# Altium schematic sheet BatteryCharger.SchDoc (part 2 of 2)
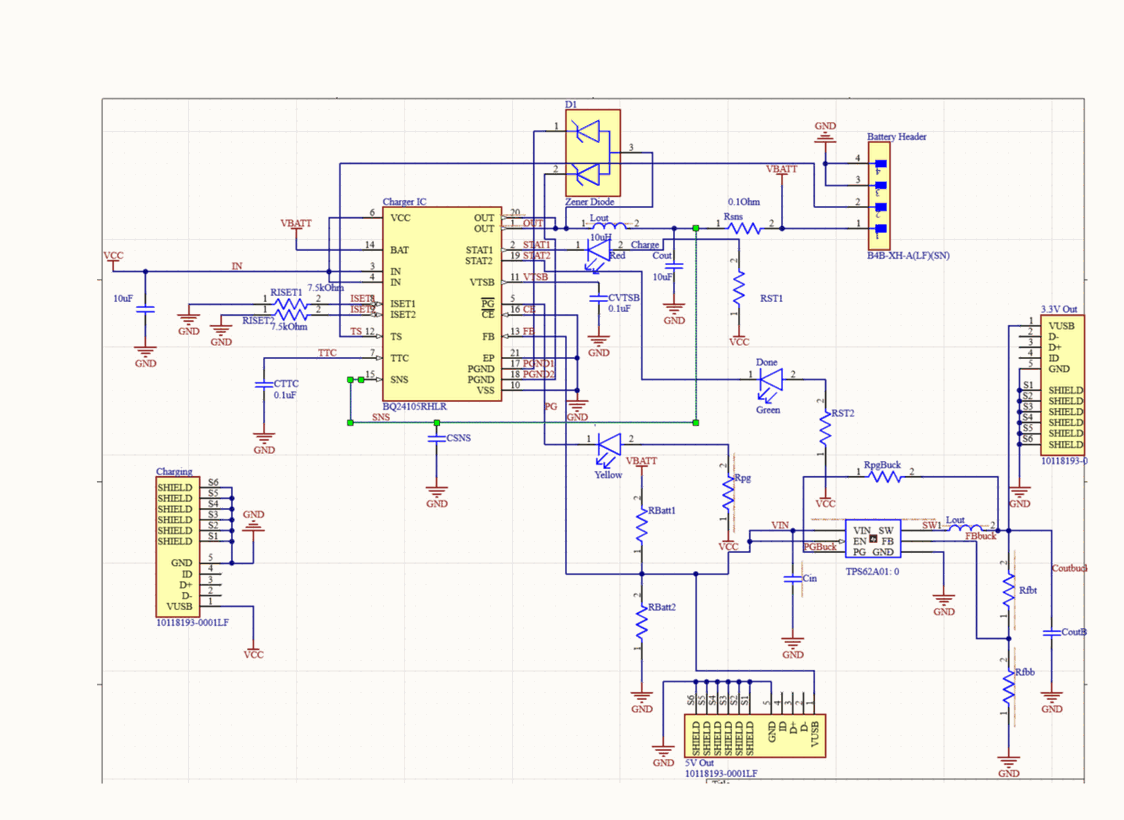
[diagram p2: BatteryCharger.SchDoc, right]

## Library data of the parts
3.3V_Out 5V_Out Charging = 10118193-0001LF: FCI Right Angle Surface Mount Mount Female USB Connector; 100 V ac; 1.8A; Manufacturer: Amphenol ICC / FCI; Connector Type: USB,Receptacle; Number of Contacts: 5; Number of Ports: 1; Insulation Resistance: 1GR; Max Voltage Rating (AC): 100V; Pitch: 0.65mm; Supplier: Allied Electronics; Supplier Part Number: 70236827; Manufacturer Part Number: 10118193-0001LF; RoHS: No; Category: USB Connectors; Mounting Technology: Surface Mount,Horizontal; Pins: 5; Contact Plating: Gold; Color: Black; Contact Material: Copper Alloy; Housing Material: Polymer; Min Operating Temperature: -55°C; Max Operating Temperature: 85°C; Packaging: Tape and Reel; Gender: Female; Termination: Solder; Series: -; Current Rating: 1.8A; Package Quantity: 1200; Orientation: Right Angle; Features: Shielded; Voltage Rating: 100V; Length: 7.86mm; Depth: 5.67mm; Radiation Hardening: No; Flammability Rating: UL94 V-0; ComponentLink1URL: http://uk.rs-online.com/webdocs/1450/0900766b814507f1.pdf?src-supplier=Rs; ComponentLink1Description: http://uk.rs-online.com/webdocs/1450/0900766b814507f1.pdf?src-supplier=Rs; ComponentLink2URL: https://cdn.amphenol-icc.com/media/wysiwyg/files/documentation/datasheet/inputoutput/io_usb_micro.pdf?src-supplier=Rs; ComponentLink2Description: https://cdn.amphenol-icc.com/media/wysiwyg/files/documentation/datasheet/inputoutput/io_usb_micro.pdf?src-supplier=Rs; ComponentLink3URL: https://cdn.amphenol-icc.com/media/wysiwyg/files/documentation/datasheet/inputoutput/io_usb_micro.pdf?src-supplier=Onlinecomponents.com; ComponentLink3Description: https://cdn.amphenol-icc.com/media/wysiwyg/files/documentation/datasheet/inputoutput/io_usb_micro.pdf?src-supplier=Onlinecomponents.com; ComponentLink4URL: https://cdn.amphenol-icc.com/media/wysiwyg/files/documentation/datasheet/inputoutput/io_usb_micro.pdf?src-supplier=Arrow+Electronics; ComponentLink4Description: https://cdn.amphenol-icc.com/media/wysiwyg/files/documentation/datasheet/inputoutput/io_usb_micro.pdf?src-supplier=Arrow+Electronics; ComponentLink5URL: https://cdn.amphenol-icc.com/media/wysiwyg/files/documentation/datasheet/inputoutput/io_usb_micro.pdf?src-supplier=Allied+Electronics; ComponentLink5Description: https://cdn.amphenol-icc.com/media/wysiwyg/files/documentation/datasheet/inputoutput/io_usb_micro.pdf?src-supplier=Allied+Electronics; ComponentLink6URL: https://cdn.amphenol-icc.com/media/wysiwyg/files/documentation/datasheet/inputoutput/io_usb_micro.pdf?src-supplier=Verical; ComponentLink6Description: https://cdn.amphenol-icc.com/media/wysiwyg/files/documentation/datasheet/inputoutput/io_usb_micro.pdf?src-supplier=Verical; ComponentLink7URL: https://cdn.amphenol-icc.com/media/wysiwyg/files/documentation/datasheet/inputoutput/io_usb_micro.pdf?src-supplier=Avnet; ComponentLink7Description: https://cdn.amphenol-icc.com/media/wysiwyg/files/documentation/datasheet/inputoutput/io_usb_micro.pdf?src-supplier=Avnet; ComponentLink8URL: https://cdn.amphenol-icc.com/media/wysiwyg/files/documentation/datasheet/inputoutput/io_usb_micro.pdf?src-supplier=Mouser; ComponentLink8Description: https://cdn.amphenol-icc.com/media/wysiwyg/files/documentation/datasheet/inputoutput/io_usb_micro.pdf?src-supplier=Mouser; ComponentLink9URL: http://www.amphenol-icc.com/media/wysiwyg/files/drawing/10118193.pdf?src-supplier=Digi-Key; ComponentLink9Description: http://www.amphenol-icc.com/media/wysiwyg/files/drawing/10118193.pdf?src-supplier=Digi-Key; ComponentLink10URL: https://cdn.amphenol-icc.com/media/wysiwyg/files/documentation/datasheet/inputoutput/io_usb_micro.pdf?src-supplier=Digi-Key; ComponentLink10Description: https://cdn.amphenol-icc.com/media/wysiwyg/files/documentation/datasheet/inputoutput/io_usb_micro.pdf?src-supplier=Digi-Key; ComponentLink11URL: https://cdn.amphenol-icc.com/media/wysiwyg/files/documentation/datasheet/inputoutput/io_usb_micro.pdf?src-supplier=Heilind+Electronics; ComponentLink11Description: https://cdn.amphenol-icc.com/media/wysiwyg/files/documentation/datasheet/inputoutput/io_usb_micro.pdf?src-supplier=Heilind+Electronics; ComponentLink12URL: https://cdn.amphenol-icc.com/media/wysiwyg/files/documentation/datasheet/inputoutput/io_usb_micro.pdf?src-supplier=TTI; ComponentLink12Description: https://cdn.amphenol-icc.com/media/wysiwyg/files/documentation/datasheet/inputoutput/io_usb_micro.pdf?src-supplier=TTI; ComponentLink13URL: https://cdn.amphenol-icc.com/media/wysiwyg/files/documentation/datasheet/inputoutput/io_usb_micro.pdf?src-supplier=TME; ComponentLink13Description: https://cdn.amphenol-icc.com/media/wysiwyg/files/documentation/datasheet/inputoutput/io_usb_micro.pdf?src-supplier=TME
10uF ? CoutBuck = TMK212BBJ106MGHT: Cap Ceramic 10uF 25V X5R 20% Pad SMD 0805 85C Low ESR Automotive T/R; Manufacturer: Taiyo Yuden; Supplier: Newark; Supplier Part Number: 16AC1902; Manufacturer Part Number: TMK212BBJ106MGHT; RoHS: Yes; Category: Ceramic Capacitors; Stock: 444; Pricing: 1=0.31000, 25=0.16600, 50=0.13900, 100=0.11200, 250=0.09800 (USD); Mounting Technology: Surface Mount; Case/Package: 0805; Min Operating Temperature: -55°C; Max Operating Temperature: 85°C; Packaging: Tape and Reel; Value: 10uF; Tolerance: 20%; Voltage Rating: 25V; Series: M; Ratings: AEC-Q200; RoHS Compliant: Yes; ComponentLink1URL: http://www.farnell.com/datasheets/2842303.pdf?src-supplier=Farnell; ComponentLink1Description: http://www.farnell.com/datasheets/2842303.pdf?src-supplier=Farnell; ComponentLink2URL: http://ds.yuden.co.jp/TYCOMPAS/ut/detail.do?productNo=TMK212BBJ106MGHT&fileName=TMK212BBJ106MGHT_SS&mode=specSheetDownload&src-supplier=Digi-Key; ComponentLink2Description: http://ds.yuden.co.jp/TYCOMPAS/ut/detail.do?productNo=TMK212BBJ106MGHT&fileName=TMK212BBJ106MGHT_SS&mode=specSheetDownload&src-supplier=Digi-Key; ComponentLink3URL: http://www.farnell.com/datasheets/2842303.pdf?src-supplier=Newark; ComponentLink3Description: http://www.farnell.com/datasheets/2842303.pdf?src-supplier=Newark
' = LYR976-PS-36: LED Uni-Color Yellow 591nm 2-Pin SMT T/R; Manufacturer: Osram Opto; Lens Color: White; Forward Current: 25mA; Forward Voltage: 2.5V; Lens Style: Flat,Diffused,Colorless,Rectangular; Luminous Intensity: 280mcd; Viewing Angle: 160°; Test Current: 20mA; Dominant Wavelength: 588nm; Luminous Flux: 0.735lm; Number of Elements: 1; Reverse Voltage: 12V; Power Dissipation: 65mW; Lens Transparency: Diffused; Lens Size: 1.25mm; Supplier: Mouser; Supplier Part Number: 720-LYR976-PS-36; Manufacturer Part Number: LYR976-PS-36; RoHS: Yes; Category: LEDs; Stock: 181357; Pricing: 1=0.30000, 10=0.16500, 50=0.16500, 100=0.07700, 500=0.07100, 1000=0.05500, 5000=0.04700, 10000=0.04300, 16000=0.03700 (USD); Mounting Technology: Surface Mount; Case/Package: 0805; Pins: 2; Color: Yellow; Case Code (Imperial): 0805; Case Code (Metric): 2012; Min Operating Temperature: -30°C; Max Operating Temperature: 85°C; Packaging: Tape and Reel; Number of LEDs: 1; Illumination Color: Yellow; Package Quantity: 16000; Series: CHIPLED 0805; Length: 2.1mm; Width: 1.25mm; Depth: 1.35mm; Radiation Hardening: No; RoHS Compliant: Yes; ComponentLink1URL: https://datasheet.ciiva.com/26883/getdatasheetpartid-623478-26883141.pdf?src-supplier=Verical; ComponentLink1Description: https://datasheet.ciiva.com/26883/getdatasheetpartid-623478-26883141.pdf?src-supplier=Verical; ComponentLink2URL: https://datasheet.ciiva.com/26937/getdatasheetpartid-569561-26937231.pdf?src-supplier=Verical; ComponentLink2Description: https://datasheet.ciiva.com/26937/getdatasheetpartid-569561-26937231.pdf?src-supplier=Verical
Battery_Header = B4B-XH-A(LF)(SN): XH Series 4 Position 2.5 mm Pitch Through Hole Crimp Top Entry Shrouded Header; Manufacturer: JST; Contact Resistance: 20mR; Current Rating: 3A; Voltage Rating (AC): 250V; Number of Positions: 4; Insulation Resistance: 1GR; Gender: Male; Wire/Cable Gauge: 22AWG; Pitch: 2.5mm; Mated Stacking Heights: 9.8mm; Supplier: Future Electronics; Supplier Part Number: 8134090; Manufacturer Part Number: B4B-XH-A(LF)(SN); RoHS: Yes; Category: Headers and Wire Housings; Stock: 310237; Pricing: 1=0.09880, 400=0.09510, 1500=0.09040, 4000=0.08710, 15000=0.07980 (USD); Mounting Technology: Through Hole; Contact Plating: Tin,Lead,Copper; Contact Material: Brass; Color: Natural; Housing Color: White; Housing Material: Polyamide; Material: Polyamide; Contact Shape: Square; Contact Finish - Mating: TIN; Insulation Material: Nylon; Insulation Color: Natural; Min Operating Temperature: -25°C; Max Operating Temperature: 85°C; Number of Rows: 1; Max Current Rating: 3A; Packaging: Bulk; Voltage Rating: 250V; Termination: Solder; Max Voltage Rating (AC): 250V; Max Voltage Rating (DC): 250V; Number of Contacts: 4; Orientation: Straight; Connector Type: Header; Series: XH; Contact Type: Male Pin; Fastening Type: Detent; Length: 12.4mm; Lead Pitch: 2.5mm; Depth: 5.75mm; Reach SVHC Compliant: No; Lead Free: Lead Free; Flammability Rating: UL94 V-0; ComponentLink1URL: https://datasheet.ciiva.com/16203/b4b-xh-alfsn-16203642.pdf?src-supplier=Future+Electronics; ComponentLink1Description: https://datasheet.ciiva.com/16203/b4b-xh-alfsn-16203642.pdf?src-supplier=Future+Electronics; ComponentLink2URL: https://datasheet.ciiva.com/26894/getdatasheetpartid-455616-26894787.pdf?src-supplier=Verical; ComponentLink2Description: https://datasheet.ciiva.com/26894/getdatasheetpartid-455616-26894787.pdf?src-supplier=Verical; ComponentLink3URL: https://datasheet.ciiva.com/26924/getdatasheetpartid-640571-26924035.pdf?src-supplier=Verical; ComponentLink3Description: https://datasheet.ciiva.com/26924/getdatasheetpartid-640571-26924035.pdf?src-supplier=Verical; ComponentLink4URL: https://datasheet.ciiva.com/726/exh-726404.pdf?src-supplier=Digi-Key; ComponentLink4Description: https://datasheet.ciiva.com/726/exh-726404.pdf?src-supplier=Digi-Key
Buck = TPS62A01ADRL_TRANS: Manufacturer: Texas Instruments; DeviceDesignator: A; DeviceNumbering: Alpha; DevicesInPackage: 1; IsHeterogeneous: False; OriginalSymbolOrigin: (20000,20000); PCB Footprint: DRL0006A-MFG; PSpiceTemplate: X^@REFDES %EN %FB %GND %PG %SW %VIN @MODEL PARAMS: ?SS|SS=@SS||SS=0|; < Value >: TPS62A01ADRL_TRANS; DevicesInView: 1; PackageName: TPS62A01ADRL; PartNumber: TPS62A01ADRL
Charge = LSR976-NR-1: Led SMT Red 0805 Tape; Manufacturer: Osram Opto; Lens Color: White; Viewing Angle: 160°; Lens Style: Flat,Diffused,Colorless,Rectangular; Dominant Wavelength: 633nm; Luminous Flux: 0.47lm; Number of LEDs: 1; Forward Current: 25mA; Forward Voltage: 2.5V; Luminous Intensity: 180mcd; Test Current: 20mA; Power Dissipation: 65mW; Reverse Voltage: 12V; Lens Transparency: Diffused; Lens Size: 1.25mm; Supplier: Avnet; Supplier Part Number: Q62702P5178; Manufacturer Part Number: LSR976-NR-1; RoHS: Yes; Category: LEDs; Stock: 76000; Pricing: 4000=0.03250, 8000=0.03167, 16000=0.03084, 24000=0.03002, 32000=0.02919, 40000=0.02836, 400000=0.02753 (USD); Mounting Technology: Surface Mount; Case/Package: 0805; Pins: 2; Color: Red; Case Code (Metric): 2012; Case Code (Imperial): 0805; Min Operating Temperature: -30°C; Max Operating Temperature: 85°C; Packaging: Tape and Reel; Illumination Color: Red; Package Quantity: 16000; Number of Elements: 1; Series: CHIPLED 0805; Length: 2.1mm; Width: 1.25mm; Height: 0.9mm; Depth: 1.35mm; Radiation Hardening: No; RoHS Compliant: Yes; ComponentLink1URL: https://datasheet.ciiva.com/4688/o-ls-ly-r976-24152-4688435.pdf?src-supplier=Mouser; ComponentLink1Description: https://datasheet.ciiva.com/4688/o-ls-ly-r976-24152-4688435.pdf?src-supplier=Mouser; ComponentLink2URL: https://datasheet.ciiva.com/26920/getdatasheetpartid-568367-26920831.pdf?src-supplier=Verical; ComponentLink2Description: https://datasheet.ciiva.com/26920/getdatasheetpartid-568367-26920831.pdf?src-supplier=Verical; ComponentLink3URL: https://datasheet.ciiva.com/2112/00078896-0-2112782.pdf?src-supplier=Digi-Key; ComponentLink3Description: https://datasheet.ciiva.com/2112/00078896-0-2112782.pdf?src-supplier=Digi-Key; ComponentLink4URL: https://datasheet.ciiva.com/2112/00078896-0-2112781.pdf?src-supplier=Digi-Key; ComponentLink4Description: https://datasheet.ciiva.com/2112/00078896-0-2112781.pdf?src-supplier=Digi-Key; ComponentLink5URL: https://datasheet.ciiva.com/2112/00078896-0-2112783.pdf?src-supplier=Digi-Key; ComponentLink5Description: https://datasheet.ciiva.com/2112/00078896-0-2112783.pdf?src-supplier=Digi-Key
Charger_IC = BQ24105RHLR: Charger IC Multi-Chemistry 20-VQFN (3.5x4.5); Manufacturer: Texas Instruments; Number of Cells: 123; Max Supply Voltage: 16V; Min Supply Voltage: 4.35V; Output Voltage: 15.5V; Output Current: 2A; Min Input Voltage: 4.3V; Switching Frequency: 1.1MHz; Max Output Voltage: 8.4V; Fault Protection: Over Voltage,Over Temperature; Supplier: Mouser; Supplier Part Number: 595-BQ24105RHLR; Manufacturer Part Number: BQ24105RHLR; RoHS: Yes; Category: Battery Management; Stock: 3270; Pricing: 1=7.70000, 10=6.95000, 50=6.63000, 100=5.75000, 1000=4.57000, 10000=4.42000 (USD); Case/Package: VQFN EP; Pins: 20; Contact Plating: Gold; Weight: 0.001668oz; Min Operating Temperature: -40°C; Max Operating Temperature: 85°C; Packaging: Tape and Reel; Package Quantity: 1; Series: bqSWITCHER™; Max Output current: 2A; Max Charge Current: 2A; Battery Pack Voltage: 15.5V; Length: 4.5mm; Width: 3.5mm; Height: 0.9mm; Radiation Hardening: No; Lead Free: Lead Free; RoHS Compliant: Yes; Reach SVHC Compliant: No; ComponentLink1URL: https://datasheet.ciiva.com/22697/1822372-22697057.pdf?src-supplier=Element14; ComponentLink1Description: https://datasheet.ciiva.com/22697/1822372-22697057.pdf?src-supplier=Element14; ComponentLink2URL: https://datasheet.ciiva.com/1144/75479-1144736.pdf?src-supplier=Newark; ComponentLink2Description: https://datasheet.ciiva.com/1144/75479-1144736.pdf?src-supplier=Newark; ComponentLink3URL: https://datasheet.ciiva.com/15114/getdatasheetpartid-188126-15114478.pdf?src-supplier=Verical; ComponentLink3Description: https://datasheet.ciiva.com/15114/getdatasheetpartid-188126-15114478.pdf?src-supplier=Verical; ComponentLink4URL: https://datasheet.ciiva.com/1932/bq24100-1932834.pdf?src-supplier=Digi-Key; ComponentLink4Description: https://datasheet.ciiva.com/1932/bq24100-1932834.pdf?src-supplier=Digi-Key; ComponentLink5URL: https://datasheet.ciiva.com/1932/bq24100-1932833.pdf?src-supplier=Digi-Key; ComponentLink5Description: https://datasheet.ciiva.com/1932/bq24100-1932833.pdf?src-supplier=Digi-Key; ComponentLink6URL: https://datasheet.ciiva.com/1932/bq24100-1932835.pdf?src-supplier=Digi-Key; ComponentLink6Description: https://datasheet.ciiva.com/1932/bq24100-1932835.pdf?src-supplier=Digi-Key; ComponentLink7URL: https://datasheet.ciiva.com/4873/slus606o-82020-4873468.pdf?src-supplier=Mouser; ComponentLink7Description: https://datasheet.ciiva.com/4873/slus606o-82020-4873468.pdf?src-supplier=Mouser; ComponentLink8URL: https://datasheet.ciiva.com/1136/1831046-1136641.pdf?src-supplier=Element14; ComponentLink8Description: https://datasheet.ciiva.com/1136/1831046-1136641.pdf?src-supplier=Element14; ComponentLink9URL: https://datasheet.ciiva.com/3213/bq24115-3213497.pdf?src-supplier=Avnet; ComponentLink9Description: https://datasheet.ciiva.com/3213/bq24115-3213497.pdf?src-supplier=Avnet
Cin = C1210C156Z8VACTU: Capacitor; Ceramic; Cap; 15uF; Tol+80%; -20%; SMT; Vol-Rtg 10V; High Cap.; Y5V; Manufacturer: KEMET; Tolerance: 80%; Dissipation Factor: 10%; Supplier: Arrow Electronics; Supplier Part Number: C1210C156Z8VACTU; Manufacturer Part Number: C1210C156Z8VACTU; RoHS: Yes; Category: Ceramic Capacitors; Stock: 1032; Pricing: 1=0.44940, 10=0.43580, 25=0.43520, 100=0.41460, 250=0.41380, 500=0.38950, 1000=0.38420 (USD); Mounting Technology: Surface Mount,PCB; Case/Package: 1210; Case Code (Imperial): 1210; Case Code (Metric): 3225; Case Code: 1210; Min Operating Temperature: -30°C; Max Operating Temperature: 85°C; Value: 15uF; Voltage Rating (DC): 10V; Dielectric: Y5V; Package Quantity: 1; Voltage Rating: 10V; Packaging: Tape and Reel; Termination: SMD/SMT; Series: C1210C; Length: 3.2mm; Width: 0.098inch; Height: 1.55mm; Depth: 2.5mm; Thickness: 0.067inch; Lead Free: Lead Free; RoHS Compliant: Yes; ComponentLink1URL: https://datasheet.ciiva.com/14599/70095383-14599054.pdf?src-supplier=Allied+Electronics; ComponentLink1Description: https://datasheet.ciiva.com/14599/70095383-14599054.pdf?src-supplier=Allied+Electronics
CSNS CTTC CVTSB = C0805C104K4RACTU: Cap Ceramic 0.1uF 16V X7R 10% SMD 0805 125°C T/R; Manufacturer: KEMET; Value: 100nF; Supplier: Newark; Supplier Part Number: 05AC8015; Manufacturer Part Number: C0805C104K4RACTU; RoHS: Yes; Category: Ceramic Capacitors; Stock: 28000; Pricing: 1=0.04200, 4000=0.04200, 10000=0.03700, 20000=0.02900, 40000=0.02200 (USD); Mounting Technology: Surface Mount,PCB; Case/Package: 0805; Pins: 2; Case Code (Imperial): 0805; Case Code (Metric): 2012; Contact Plating: Tin,Matte; Dielectric Material: Ceramic; Min Operating Temperature: -55°C; Max Operating Temperature: 125°C; Packaging: Tape and Reel; Package Quantity: 4000; Tolerance: 10%; Voltage Rating: 16V; Voltage Rating (DC): 16V; Dielectric: X7R; Termination: SMD/SMT; Voltage: 16V; Series: SMD Comm X7R; Construction: Flat; Length: 2mm; Height: 0.9mm; Lead Pitch: 0.75mm; Depth: 1.25mm; Radiation Hardening: No; Reach SVHC Compliant: No; RoHS Compliant: Yes; ComponentLink1URL: https://datasheet.ciiva.com/46443/1851736-46443710.pdf?src-supplier=Element14; ComponentLink1Description: https://datasheet.ciiva.com/46443/1851736-46443710.pdf?src-supplier=Element14; ComponentLink2URL: https://datasheet.ciiva.com/46443/1851736-46443711.pdf?src-supplier=Element14; ComponentLink2Description: https://datasheet.ciiva.com/46443/1851736-46443711.pdf?src-supplier=Element14
D1 = MMBZ18VALT1G: ESD Suppressor Diode Zener Uni-Dir/Bi-Dir 14.5V 3-Pin SOT-23 T/R; Manufacturer: ON Semiconductor; Max Surge Current: 1.6A; Direction: Unidirectional; Number of Unidirectional Channels: 2; Min Breakdown Voltage: 17.1V; Clamping Voltage: 25V; Peak Pulse Power: 40W; Power Line Protection: No; Test Current: 1mA; Leakage Current: 50nA; Voltage Rating (DC): 18V; Max Power Dissipation: 225mW; ESD Protection: Yes; Max Breakdown Voltage: 18.9V; Supplier: Future Electronics; Supplier Part Number: 7295033; Manufacturer Part Number: MMBZ18VALT1G; RoHS: Yes; Category: Zener Diodes; Stock: 144000; Pricing: 3000=0.02150, 12000=0.02060, 45000=0.01970, 75000=0.01940, 150000=0.01850 (USD); Case/Package: SOT-23-3; Pins: 3; Min Operating Temperature: -55°C; Max Operating Temperature: 150°C; Packaging: Tape and Reel; Series: -; Package Quantity: 3000; Operating Supply Voltage: 14.5V; Reverse Standoff Voltage: 14.5V; Polarity: Unidirectional; Number of Channels: 2; Breakdown Voltage: 17.1V; Termination: SMD/SMT; Peak Pulse Current: 1.6A; Diode Type: ZENER; Number of Elements: 2; Reverse Breakdown Voltage: 17.1V; Working Voltage: 14.5V; Max Reverse Leakage Current: 50nA; Power Dissipation: 40W; Clamping Voltage-Max: 25V; Length: 2.9mm; Width: 1.4mm; Height: 1.01mm; Depth: 1.3mm; Radiation Hardening: No; RoHS Compliant: Yes; Lead Free: Lead Free; Reach SVHC Compliant: No; ComponentLink1URL: https://datasheet.ciiva.com/15143/getdatasheetpartid-110231-15143507.pdf?src-supplier=Verical; ComponentLink1Description: https://datasheet.ciiva.com/15143/getdatasheetpartid-110231-15143507.pdf?src-supplier=Verical; ComponentLink2URL: https://datasheet.ciiva.com/4507/mmbz5v6alt1-d-4507882.pdf?src-supplier=Mouser; ComponentLink2Description: https://datasheet.ciiva.com/4507/mmbz5v6alt1-d-4507882.pdf?src-supplier=Mouser; ComponentLink3URL: https://datasheet.ciiva.com/3304/mmbz5v6alt1-d-3304031.pdf?src-supplier=Avnet; ComponentLink3Description: https://datasheet.ciiva.com/3304/mmbz5v6alt1-d-3304031.pdf?src-supplier=Avnet; ComponentLink4URL: https://datasheet.ciiva.com/16379/mmbz5v6alt1-d-16379322.pdf?src-supplier=Future+Electronics; ComponentLink4Description: https://datasheet.ciiva.com/16379/mmbz5v6alt1-d-16379322.pdf?src-supplier=Future+Electronics; ComponentLink5URL: https://datasheet.ciiva.com/339/mmbz5v6alt1-d-339743.pdf?src-supplier=Digi-Key; ComponentLink5Description: https://datasheet.ciiva.com/339/mmbz5v6alt1-d-339743.pdf?src-supplier=Digi-Key; ComponentLink6URL: https://datasheet.ciiva.com/339/mmbz5v6alt1-d-339744.pdf?src-supplier=Digi-Key; ComponentLink6Description: https://datasheet.ciiva.com/339/mmbz5v6alt1-d-339744.pdf?src-supplier=Digi-Key; ComponentLink7URL: https://datasheet.ciiva.com/339/mmbz5v6alt1-d-339742.pdf?src-supplier=Digi-Key; ComponentLink7Description: https://datasheet.ciiva.com/339/mmbz5v6alt1-d-339742.pdf?src-supplier=Digi-Key
Done = LGR971-KN-1: LED Uni-Color Green 572nm 2-Pin Chip 0805(2012Metric) T/R; Manufacturer: Osram Opto; Forward Current: 25mA; Forward Voltage: 2.5V; Lens Style: Diffused,Colorless,Rectangular; Luminous Intensity: 45mcd; Viewing Angle: 160°; Test Current: 20mA; Dominant Wavelength: 570nm; Number of Elements: 1; Reverse Voltage: 12V; Luminous Flux: 0.1lm; Power Dissipation: 65mW; Supplier: Future Electronics; Supplier Part Number: 1152237; Manufacturer Part Number: LGR971-KN-1; RoHS: Yes; Category: Uncategorized; Stock: 112000; Pricing: 16000=0.03030, 32000=0.02960, 48000=0.02920, 64000=0.02890, 80000=0.02800 (USD); Mounting Technology: Surface Mount; Case/Package: SMD/SMT; Pins: 2; Color: Green; Min Operating Temperature: -30°C; Max Operating Temperature: 85°C; Packaging: Tape and Reel; Number of LEDs: 1; Series: CHipLED; Package Quantity: 16000; Length: 2.1mm; Width: 1.25mm; Height: 0.8mm; Depth: 1.35mm; Radiation Hardening: No; RoHS Compliant: Yes; ComponentLink1URL: https://datasheet.ciiva.com/4688/g-r971-221296-4688589.pdf?src-supplier=Mouser; ComponentLink1Description: https://datasheet.ciiva.com/4688/g-r971-221296-4688589.pdf?src-supplier=Mouser; ComponentLink2URL: https://datasheet.ciiva.com/15198/getdatasheetpartid-233880-15198360.pdf?src-supplier=Verical; ComponentLink2Description: https://datasheet.ciiva.com/15198/getdatasheetpartid-233880-15198360.pdf?src-supplier=Verical; ComponentLink3URL: https://datasheet.ciiva.com/15198/getdatasheetpartid-462214-15198395.pdf?src-supplier=Verical; ComponentLink3Description: https://datasheet.ciiva.com/15198/getdatasheetpartid-462214-15198395.pdf?src-supplier=Verical; ComponentLink4URL: https://datasheet.ciiva.com/14918/00078860-0-14918605.pdf?src-supplier=Digi-Key; ComponentLink4Description: https://datasheet.ciiva.com/14918/00078860-0-14918605.pdf?src-supplier=Digi-Key; ComponentLink5URL: https://datasheet.ciiva.com/14918/00078860-0-14918604.pdf?src-supplier=Digi-Key; ComponentLink5Description: https://datasheet.ciiva.com/14918/00078860-0-14918604.pdf?src-supplier=Digi-Key; ComponentLink6URL: https://datasheet.ciiva.com/14918/00078860-0-14918606.pdf?src-supplier=Digi-Key; ComponentLink6Description: https://datasheet.ciiva.com/14918/00078860-0-14918606.pdf?src-supplier=Digi-Key
Lout = TFM322512ALMA100MTAA: Inductor Power Shielded Thin Film 10uH 20% 1MHz Metal 1.2A 0.36Ohm DCR 1210 Automotive T/R; Manufacturer: TDK; Saturation Current: 1.6A; DC Resistance (DCR): 360mR; Supplier: Arrow Electronics; Supplier Part Number: TFM322512ALMA100MTAA; Manufacturer Part Number: TFM322512ALMA100MTAA; RoHS: Yes; Category: Fixed Inductors; Stock: 10000; Pricing: 2000=0.36750, 4000=0.35360, 6000=0.35010, 10000=0.34660 (USD); Mounting Technology: Surface Mount; Case/Package: 1210; Core Material: Metal; Min Operating Temperature: -55°C; Max Operating Temperature: 150°C; Series: TFM-ALMA; Tolerance: 20%; Shielding: Shielded; Value: 10uH; Test Frequency: 1MHz; Ratings: AEC-Q200; RoHS Compliant: Yes
LoutBuck = DFE322520FD-1R0M=P2: Inductor Power Shielded Wirewound 1uH 20% 1MHz Metal 4.1A 0.022Ohm DCR 1210 Automotive T/R; Manufacturer: Murata; Supplier: Arrow Electronics; Supplier Part Number: DFE322520FD-1R0M=P2; Manufacturer Part Number: DFE322520FD-1R0M=P2; RoHS: Yes; Category: Fixed Inductors; Stock: 14; Pricing: 1=0.83780, 10=0.65160 (USD)
RBatt1 = CRCW1210121KFKEA: Res Thick Film 1210 121K Ohm 1% 1/2W ±100ppm/°C Molded SMD SMD Paper T/R; Manufacturer: Vishay Dale; Value: 121kR; Power Rating: 500mW; Voltage Rating: 200V; Supplier: Mouser; Supplier Part Number: 71-CRCW1210-121K-E3; Manufacturer Part Number: CRCW1210121KFKEA; RoHS: Yes; Category: Chip SMD Resistors; Stock: 10271; Pricing: 1=0.25000, 10=0.21500, 50=0.21500, 100=0.09000, 1000=0.04100, 10000=0.03400 (USD); Case/Package: 1210; Weight: 0.000564oz; Case Code (Imperial): 1210; Case Code (Metric): 3225; Contact Plating: Tin; Min Operating Temperature: -55°C; Max Operating Temperature: 155°C; Tolerance: 1%; Packaging: Tape and Reel; Package Quantity: 5000; Temperature Coefficient: 100ppm/°C; Features: Automotive AEC-Q200; Series: CRCW; Max Power Dissipation: 500mW; Number of Terminations: 2; Voltage Rating (DC): 200V; Length: 3.2mm; Width: 2.5mm; Height: 0.55mm; Radiation Hardening: No; Lead Free: Lead Free; RoHS Compliant: Yes; ComponentLink1URL: https://datasheet.ciiva.com/5548/dcrcwe3-109170-5548951.pdf?src-supplier=Mouser; ComponentLink1Description: https://datasheet.ciiva.com/5548/dcrcwe3-109170-5548951.pdf?src-supplier=Mouser; ComponentLink2URL: https://datasheet.ciiva.com/8975/dcrcwe3-8975144.pdf?src-supplier=Avnet; ComponentLink2Description: https://datasheet.ciiva.com/8975/dcrcwe3-8975144.pdf?src-supplier=Avnet; ComponentLink3URL: https://datasheet.ciiva.com/16391/dcrcwe3-16391478.pdf?src-supplier=Future+Electronics; ComponentLink3Description: https://datasheet.ciiva.com/16391/dcrcwe3-16391478.pdf?src-supplier=Future+Electronics
RBatt2 Rfbb = CRCW1210100KFKEAHP: Res Thick Film 1210 100K Ohm 1% 0.75W(3/4W) ±100ppm/C Pad SMD Automotive T/R; Manufacturer: Vishay Dale; Voltage Rating: 200V; Value: 100kR; Power Rating: 750mW; Temperature Coefficient: 100ppm/°C; Supplier: Mouser; Supplier Part Number: 71-CRCW1210100KFKEAH; Manufacturer Part Number: CRCW1210100KFKEAHP; RoHS: Yes; Category: Chip SMD Resistors; Stock: 14700; Pricing: 1=0.66000, 10=0.48900, 50=0.48900, 100=0.25500, 1000=0.16000, 2500=0.15500, 5000=0.15100, 10000=0.15100 (USD); Case/Package: 1210; Weight: 0.000564oz; Case Code (Imperial): 1210; Case Code (Metric): 3225; Min Operating Temperature: -55°C; Max Operating Temperature: 155°C; Packaging: Tape and Reel; Package Quantity: 5000; Tolerance: 1%; Termination: SMD/SMT; Features: Automotive AEC-Q200; Series: CRCW-HP; Max Power Dissipation: 750mW; Number of Terminations: 2; Length: 3.2mm; Width: 2.5mm; Height: 0.6mm; Lead Free: Lead Free; RoHS Compliant: Yes; ComponentLink1URL: https://datasheet.ciiva.com/5549/crcwhpe3-46056-5549052.pdf?src-supplier=Mouser; ComponentLink1Description: https://datasheet.ciiva.com/5549/crcwhpe3-46056-5549052.pdf?src-supplier=Mouser
Rfbt = ERJ-P14F4533U: Res Thick Film 1210 453K Ohm 1% 1/2W ±100ppm/°C Molded SMD SMD Embossed Carrier T/R; Manufacturer: Panasonic; Value: 453kR; Power Rating: 500mW; Voltage Rating: 200V; Supplier: Mouser; Supplier Part Number: 667-ERJ-P14F4533U; Manufacturer Part Number: ERJ-P14F4533U; RoHS: Yes; Category: Chip SMD Resistors; Stock: 4871; Pricing: 1=0.54000, 10=0.38700, 50=0.38700, 100=0.15400, 1000=0.07100, 10000=0.05600 (USD); Mounting Technology: Surface Mount; Case/Package: 1210; Case Code (Imperial): 1210; Case Code (Metric): 3225; Contact Plating: Tin; Min Operating Temperature: -55°C; Max Operating Temperature: 155°C; Tolerance: 1%; Packaging: Tape and Reel; Package Quantity: 5000; Resistor Type: Thick Film; Termination: SMD/SMT; Temperature Coefficient: 100ppm/°C; Voltage Rating (DC): 200V; Features: Automotive AEC-Q200; Series: ERJ; Max Power Dissipation: 500mW; Number of Terminations: 2; Resistance Tolerance: 1%; Length: 3.2mm; Width: 2.5mm; Height: 0.6mm; Ratings: AEC-Q200; Reach SVHC Compliant: No; RoHS Compliant: Yes; ComponentLink1URL: https://datasheet.ciiva.com/22721/1801181-22721902.pdf?src-supplier=Farnell; ComponentLink1Description: https://datasheet.ciiva.com/22721/1801181-22721902.pdf?src-supplier=Farnell; ComponentLink2URL: https://datasheet.ciiva.com/22668/1801181-22668505.pdf?src-supplier=Element14; ComponentLink2Description: https://datasheet.ciiva.com/22668/1801181-22668505.pdf?src-supplier=Element14; ComponentLink3URL: https://datasheet.ciiva.com/46382/1801181-46382281.pdf?src-supplier=Element14; ComponentLink3Description: https://datasheet.ciiva.com/46382/1801181-46382281.pdf?src-supplier=Element14; ComponentLink4URL: https://datasheet.ciiva.com/24070/aoa0000ce4-64075-24070265.pdf?src-supplier=Mouser; ComponentLink4Description: https://datasheet.ciiva.com/24070/aoa0000ce4-64075-24070265.pdf?src-supplier=Mouser
RISET1 RISET2 = ERJP14F7501U: Res Thick Film 1210 7.5K Ohm 1% 1/2W ±100ppm/°C Molded SMD Embossed Carrier T/R; Manufacturer: Panasonic; Value: 7.5kR; Power Rating: 500mW; Voltage Rating: 200V; Supplier: Mouser; Supplier Part Number: 667-ERJ-P14F7501U; Manufacturer Part Number: ERJP14F7501U; RoHS: Yes; Category: Chip SMD Resistors; Stock: 3156; Pricing: 1=0.54000, 10=0.38700, 50=0.38700, 100=0.15500, 1000=0.08700, 10000=0.05600 (USD); Mounting Technology: Surface Mount; Case/Package: 1210; Pins: 2; Case Code (Imperial): 1210; Case Code (Metric): 3225; Weight: 0.000564oz; Contact Plating: Tin; Min Operating Temperature: -55°C; Max Operating Temperature: 155°C; Tolerance: 1%; Packaging: Tape and Reel; Package Quantity: 5000; Resistor Type: Thick Film; Termination: SMD/SMT; Temperature Coefficient: 100ppm/°C; Voltage Rating (DC): 200V; Series: ERJ-P14; Technology: THICK FILM; Resistance Tolerance: 1%; Length: 3.2mm; Width: 2.5mm; Height: 0.6mm; Depth: 2.5mm; Reach SVHC Compliant: No; RoHS Compliant: Yes; ComponentLink1URL: https://datasheet.ciiva.com/11817/0900766b812cb812-11817425.pdf?src-supplier=Rs; ComponentLink1Description: https://datasheet.ciiva.com/11817/0900766b812cb812-11817425.pdf?src-supplier=Rs; ComponentLink2URL: https://datasheet.ciiva.com/7836/1790600-7836703.pdf?src-supplier=Element14; ComponentLink2Description: https://datasheet.ciiva.com/7836/1790600-7836703.pdf?src-supplier=Element14; ComponentLink3URL: https://datasheet.ciiva.com/5868/aoa0000ce4-5868361.pdf?src-supplier=Farnell; ComponentLink3Description: https://datasheet.ciiva.com/5868/aoa0000ce4-5868361.pdf?src-supplier=Farnell; ComponentLink4URL: https://datasheet.ciiva.com/22699/1801181-22699306.pdf?src-supplier=Element14; ComponentLink4Description: https://datasheet.ciiva.com/22699/1801181-22699306.pdf?src-supplier=Element14; ComponentLink5URL: https://datasheet.ciiva.com/24192/aoa0000ce4-64075-24192329.pdf?src-supplier=Mouser; ComponentLink5Description: https://datasheet.ciiva.com/24192/aoa0000ce4-64075-24192329.pdf?src-supplier=Mouser; ComponentLink6URL: https://datasheet.ciiva.com/9194/aoa0000ce4-9194893.pdf?src-supplier=Avnet; ComponentLink6Description: https://datasheet.ciiva.com/9194/aoa0000ce4-9194893.pdf?src-supplier=Avnet
Rpg RST1 RST2 = ERJ-S14J152U: Res Thick Film 1210 1.5K Ohm 5% 1/2W ±200ppm/°C Molded SMD SMD Embossed Carrier T/R; Manufacturer: Panasonic; Value: 1.5kR; Power Rating: 500mW; Voltage Rating: 200V; Voltage Rating (DC): 400V; Current Rating: 2A; Supplier: Mouser; Supplier Part Number: 667-ERJ-S14J152U; Manufacturer Part Number: ERJ-S14J152U; RoHS: Yes; Category: Chip SMD Resistors; Stock: 72; Pricing: 1=0.51000, 10=0.36600, 50=0.36600, 100=0.14600, 1000=0.07200, 10000=0.05700 (USD); Mounting Technology: Surface Mount; Case/Package: 1210; Case Code (Imperial): 1210; Case Code (Metric): 3225; Contact Plating: Tin; Min Operating Temperature: -55°C; Max Operating Temperature: 155°C; Packaging: Tape and Reel; Tolerance: 5%; Package Quantity: 5000; Termination: SMD/SMT; Number of Terminations: 2; Temperature Coefficient: 200ppm/°C; Max Power Dissipation: 500mW; Features: Anti-Sulfur; Series: ERJ; Length: 0.126inch; Width: 2.5mm; Height: 0.028inch; Lead Free: Lead Free; RoHS Compliant: Yes; ComponentLink1URL: https://datasheet.ciiva.com/9198/aoa0000ce5-9198330.pdf?src-supplier=Avnet; ComponentLink1Description: https://datasheet.ciiva.com/9198/aoa0000ce5-9198330.pdf?src-supplier=Avnet
RpgBuck = ERJP14F4993U: Res Thick Film 1210 499K Ohm 1% 0.5W ±100ppm/°C Molded SMD Embossed Carrier T/R; Manufacturer: Panasonic; Value: 499kR; Power Rating: 500mW; Voltage Rating: 200V; Supplier: Mouser; Supplier Part Number: 667-ERJ-P14F4993U; Manufacturer Part Number: ERJP14F4993U; RoHS: Yes; Category: Chip SMD Resistors; Stock: 4678; Pricing: 1=0.50000, 10=0.35900, 50=0.35900, 100=0.14400, 1000=0.07100, 10000=0.05900 (USD); Mounting Technology: Surface Mount; Case/Package: 1210; Case Code (Imperial): 1210; Case Code (Metric): 3225; Weight: 0.000564oz; Contact Plating: Tin; Min Operating Temperature: -55°C; Max Operating Temperature: 155°C; Tolerance: 1%; Packaging: Tape and Reel; Package Quantity: 5000; Resistor Type: Thick Film; Termination: SMD/SMT; Temperature Coefficient: 100ppm/°C; Voltage Rating (DC): 200V; Series: ERJ-P14; Resistance Tolerance: 1%; Length: 3.2mm; Width: 2.5mm; Height: 0.6mm; Reach SVHC Compliant: No; RoHS Compliant: Yes; ComponentLink1URL: https://datasheet.ciiva.com/22721/1801181-22721215.pdf?src-supplier=Farnell; ComponentLink1Description: https://datasheet.ciiva.com/22721/1801181-22721215.pdf?src-supplier=Farnell; ComponentLink2URL: https://datasheet.ciiva.com/22672/1801181-22672950.pdf?src-supplier=Element14; ComponentLink2Description: https://datasheet.ciiva.com/22672/1801181-22672950.pdf?src-supplier=Element14; ComponentLink3URL: https://datasheet.ciiva.com/46382/1801181-46382826.pdf?src-supplier=Element14; ComponentLink3Description: https://datasheet.ciiva.com/46382/1801181-46382826.pdf?src-supplier=Element14; ComponentLink4URL: https://datasheet.ciiva.com/24208/aoa0000ce4-64075-24208767.pdf?src-supplier=Mouser; ComponentLink4Description: https://datasheet.ciiva.com/24208/aoa0000ce4-64075-24208767.pdf?src-supplier=Mouser; ComponentLink5URL: https://datasheet.ciiva.com/9181/aoa0000ce4-9181562.pdf?src-supplier=Avnet; ComponentLink5Description: https://datasheet.ciiva.com/9181/aoa0000ce4-9181562.pdf?src-supplier=Avnet
Rsns = ERJ14RSFR10U: Res Thick Film 1210 0.1 Ohm 1% 1/4W ±200ppm/°C Molded SMD Embossed Carrier T/R; Manufacturer: Panasonic; Value: 100mR; Power Rating: 250mW; Voltage Rating: 200V; Supplier: Newark; Supplier Part Number: 63W0528; Manufacturer Part Number: ERJ14RSFR10U; RoHS: Yes; Category: Chip SMD Resistors; Stock: 365; Pricing: 1=1.00000, 10=0.37200, 25=0.34300, 50=0.31500, 100=0.28600, 250=0.27800 (USD); Mounting Technology: Surface Mount; Case/Package: 1210; Pins: 2; Case Code (Imperial): 1210; Case Code (Metric): 3225; Contact Plating: Tin; Min Operating Temperature: -55°C; Max Operating Temperature: 125°C; Tolerance: 1%; Packaging: Tape and Reel; Package Quantity: 5000; Resistor Type: Thick Film; Termination: SMD/SMT; Temperature Coefficient: 200ppm/°C; Technology: THICK FILM; Series: ERJ; Resistance Tolerance: 1%; Length: 3.2mm; Width: 2.5mm; Height: 0.6mm; Depth: 2.5mm; Reach SVHC Compliant: No; RoHS Compliant: Yes; ComponentLink1URL: https://datasheet.ciiva.com/11818/0900766b80eefa12-11818672.pdf?src-supplier=Rs; ComponentLink1Description: https://datasheet.ciiva.com/11818/0900766b80eefa12-11818672.pdf?src-supplier=Rs; ComponentLink2URL: https://datasheet.ciiva.com/6137/391509-6137455.pdf?src-supplier=Farnell; ComponentLink2Description: https://datasheet.ciiva.com/6137/391509-6137455.pdf?src-supplier=Farnell; ComponentLink3URL: https://datasheet.ciiva.com/7944/391509-7944584.pdf?src-supplier=Element14; ComponentLink3Description: https://datasheet.ciiva.com/7944/391509-7944584.pdf?src-supplier=Element14; ComponentLink4URL: https://datasheet.ciiva.com/6137/391509-6137436.pdf?src-supplier=Farnell; ComponentLink4Description: https://datasheet.ciiva.com/6137/391509-6137436.pdf?src-supplier=Farnell; ComponentLink5URL: https://datasheet.ciiva.com/7944/391509-7944583.pdf?src-supplier=Element14; ComponentLink5Description: https://datasheet.ciiva.com/7944/391509-7944583.pdf?src-supplier=Element14; ComponentLink6URL: https://datasheet.ciiva.com/24056/aoa0000ce3-72189-24056939.pdf?src-supplier=Mouser; ComponentLink6Description: https://datasheet.ciiva.com/24056/aoa0000ce3-72189-24056939.pdf?src-supplier=Mouser; ComponentLink7URL: https://datasheet.ciiva.com/9186/aoa0000ce3-9186712.pdf?src-supplier=Avnet; ComponentLink7Description: https://datasheet.ciiva.com/9186/aoa0000ce3-9186712.pdf?src-supplier=Avnet